# EAGLE design PCBPayloadV8 (EAGLE 9.5.2)
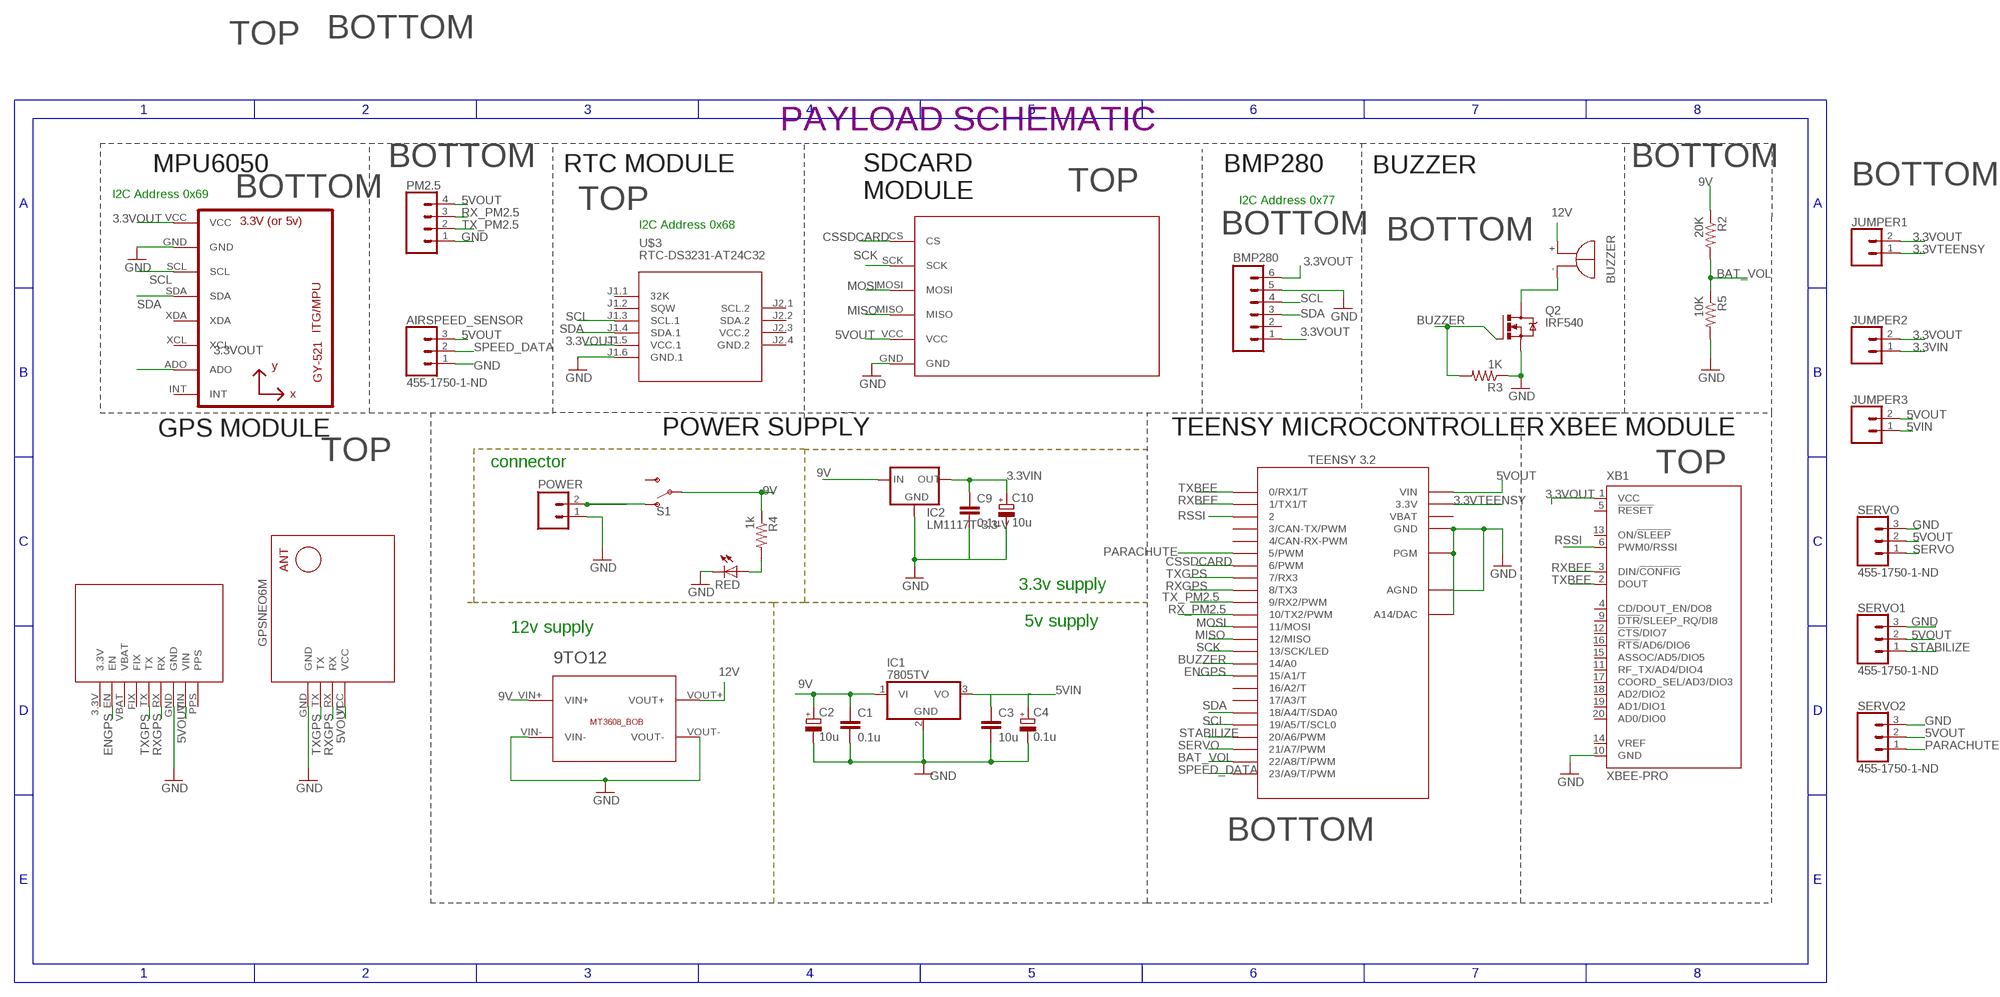
[diagram p0: schematic, sheet 1]

## Parts
9TO12  BREAKOUTS_MT3608_BOB  [BREAKOUTS_MT3608_BOB]
AIRSPEED_SENSOR  455-1750-1-ND  CONN_03  [1X03]
BMP280  M06  [06P]
C1  0.1u  C-EU025-025X050  [C025-025X050]
C2  10u  CPOL-EUE2.5-6  [E2,5-6]
C3  10u  C-EU025-025X050  [C025-025X050]
C4  0.1u  CPOL-EUE2.5-6  [E2,5-6]
C9  0.1u  C-EU025-025X050  [C025-025X050]
C10  10u  CPOL-EUE2.5-6  [E2,5-6]
IC1  7805TV  [TO220V]
IC2  LM1117T-3.3-V  [TO220V]
JUMPER1  CONN_02  [1X02]
JUMPER2  CONN_02  [1X02]
JUMPER3  CONN_02  [1X02]
PM2.5  CONN_04  [1X04]
POWER  CEDT_JANUARY_2015_V5_M02  [CEDT_JANUARY_2015_V5_02P]
Q2  IRF540  [TO220BV]
R2  20K  R-US_0204/7  [0204/7]
R3  1K  R-US_0204/7  [0204/7]
R4  1k  R-US_0204/7  [0204/7]
R5  10K  R-US_0204/7  [0204/7]
RED  red  LED3MM  [LED3MM]
S1  SWITCH-SPDT-PTH-11.6X4.0MM  [SWITCH_SPDT_PTH_11.6X4.0MM]
SERVO  455-1750-1-ND  CONN_03  [1X03]
SERVO1  455-1750-1-ND  CONN_03  [1X03]
SERVO2  455-1750-1-ND  CONN_03  [1X03]
SG1  BUZZER_EB2209A  [BUZZER_EB2209A]
U1  GY-521MPU6050  [GY-521]
U$1  GPS-RECEIVER-NEO6M  [GPS-RECEIVER-NEO6M]
U$2  TEENSY_3.1-3.2_OUTER_ROW  [TEENSY_3.0-3.2&LC_OUTER_ROW]
U$3  RTC-DS3231-AT24C32  [RTC-DS3231-AT24C32]
U$4  ADAFRUIT_GPS  [ADAFRUIT_GPS]
U$5  SDCARD  [M0SDCARDMODULE]
XB1  XBEE-PRO  [XBEE-PRO]

## Nets
3.3VIN: C9.1 C10.+ IC2.2(OUT) JUMPER2.1
3.3VOUT: BMP280.1 BMP280.6 JUMPER1.2 JUMPER2.2 U1.ADO U1.VCC U$3.J1.5(VCC.1) XB1.1(VCC)
3.3VTEENSY: JUMPER1.1 U$2.3.3V U$2.3.3V1(3.3V)
5VIN [power]: C3.1 C4.+ IC1.3(VO) JUMPER3.1
5VOUT: AIRSPEED_SENSOR.3 JUMPER3.2 PM2.5.4 SERVO1.2 SERVO2.2 SERVO.2 U$1.VCC U$2.VIN U$4.VIN U$5.VCC
9V [power]: 9TO12.VIN+ C1.1 C2.+ IC1.1(VI) IC2.3(IN) R2.1 R4.1 S1.2(P)
12V [power]: 9TO12.VOUT+ SG1.+
BAT_VOL: R2.2 R5.1 U$2.22/A8(22/A8/T/PWM)
BUZZER: Q2.G R3.2 U$2.14/A0
CSSDCARD: U$2.6(6/PWM) U$5.CS
ENGPS: U$2.15/A1(15/A1/T) U$4.EN
GND [power]: 9TO12.VIN- 9TO12.VOUT- AIRSPEED_SENSOR.1 BMP280.5 C1.2 C2.- C3.2 C4.- C9.2 C10.- IC1.2(GND) IC2.1(GND) PM2.5.1 POWER.1 Q2.S R3.1 R5.2 RED.K(C) SERVO1.3 SERVO2.3 SERVO.3 U1.GND U$1.GND U$2.AGND U$2.GND U$2.GND1(GND) U$2.PGM U$2.RESET/DAC(A14/DAC) U$3.J1.6(GND.1) U$4.GND U$5.GND XB1.10(GND)
MISO: U$2.12(12/MISO) U$5.MISO
MOSI: U$2.11(11/MOSI) U$5.MOSI
N$1 [power]: POWER.2 S1.1(O)
N$2: R4.2 RED.A
N$3 [power]: Q2.D SG1.-
PARACHUTE: SERVO2.1 U$2.5(5/PWM)
RSSI: U$2.2 XB1.6(PWM0/RSSI)
RX_PM2.5: PM2.5.3 U$2.10(10/TX2/PWM)
RXBEE: U$2.1(1/TX1/T) XB1.3(DIN/!CONFIG)
RXGPS: U$1.RX U$2.8(8/TX3) U$4.RX
SCK: U$2.13(13/SCK/LED) U$5.SCK
SCL: BMP280.4 U1.SCL U$2.19/A5(19/A5/T/SCL0) U$3.J1.3(SCL.1)
SDA: BMP280.3 U1.SDA U$2.18/A4(18/A4/T/SDA0) U$3.J1.4(SDA.1)
SERVO: SERVO.1 U$2.21/A7(21/A7/PWM)
SPEED_DATA: AIRSPEED_SENSOR.2 U$2.23/A9(23/A9/T/PWM)
STABILIZE: SERVO1.1 U$2.20/A6(20/A6/PWM)
TX_PM2.5: PM2.5.2 U$2.9(9/RX2/PWM)
TXBEE: U$2.0(0/RX1/T) XB1.2(DOUT)
TXGPS: U$1.TX U$2.7(7/RX3) U$4.TX
Unconnected: BMP280.2 S1.3(S) U1.INT U1.XCL U1.XDA U$2.3(3/CAN-TX/PWM) U$2.4(4/CAN-RX-PWM) U$2.16/A2(16/A2/T) U$2.17/A3(17/A3/T) U$3.J1.1(32K) U$3.J1.2(SQW) U$3.J2.1(SCL.2) U$3.J2.2(SDA.2) U$4.3.3V U$4.FIX U$4.PPS U$4.VBAT XB1.4(CD/DOUT_EN/DO8) XB1.5(!RESET) XB1.9(!DTR!/SLEEP_RQ/DI8) XB1.11(RF_TX/AD4/DIO4) XB1.12(!CTS!/DIO7) XB1.13(ON/!SLEEP) XB1.14(VREF) XB1.15(ASSOC/AD5/DIO5) XB1.16(!RTS!/AD6/DIO6) XB1.17(COORD_SEL/AD3/DIO3) XB1.18(AD2/DIO2) XB1.19(AD1/DIO1) XB1.20(AD0/DIO0)

## Notes on the sheet
- TOP | BOTTOM
- PAYLOAD SCHEMATIC
- MPU6050 | BOTTOM | RTC MODULE | BMP280 | BUZZER | BOTTOM
- TOP | BOTTOM
- I2C Address 0x69 | BOTTOM
- SDCARD
  MODULE
- I2C Address 0x77
- TOP
- I2C Address 0x68
- BOTTOM | BOTTOM
- GPS MODULE | POWER SUPPLY | TEENSY MICROCONTROLLER | XBEE MODULE
- TOP
- connector
- TOP
- 3.3v supply
- 5v supply
- 12v supply
- BOTTOM

## Power pins joined to a net without a drawn wire
GND.2: U$3.J2.4(GND.2)
VBAT: U$2.VBAT
VCC.2: U$3.J2.3(VCC.2)

## Library data of the parts
9TO12 = Cansat2019_3279_Container_v01:BREAKOUTS_MT3608_BOB
AIRSPEED_SENSOR SERVO SERVO1 SERVO2 = SparkFun-Connectors:CONN_03: Multi connection point. Often used as Generic Header-pin footprint for 0.1 inch spaced/style header connections On any of the 0.1 inch spaced packages, you can populate with these: Break Away Headers - Straight <https://www.sparkfun.com/products/116> (PRT-00116) Break Away Male Headers - Right Angle <https://www.sparkfun.com/products/553> (PRT-00553) Female Headers <https://www.sparkfun.com/products/115> (PRT-00115) Break Away Headers - Machine Pin <https://www.sparkfun.com/products/117> (PRT-00117) Break Away Female Headers - Swiss Machine Pin <https://www.sparkfun.com/products/743> (PRT-00743) Stackable Header - 3 Pin (Female, 0.1") <https://www.sparkfun.com/products/13875> (PRT-13875) For SCREWTERMINALS and SPRING TERMINALS visit here: Screw Terimnals on SparkFun.com <https://www.sparkfun.com/search/results?term=Screw+Terminals> (5mm/3.5mm/2.54mm spacing) This device is also useful as a general connection point to wire up your design to another part of your project. Our various solder wires solder well into these plated through hole pads. Hook-Up Wire - Assortment (Stranded, 22 AWG) <https://www.sparkfun.com/products/11375> (PRT-11375) Hook-Up Wire - Assortment (Solid Core, 22 AWG) <https://www.sparkfun.com/products/11367> (PRT-11367) View the entire wire category on our website here <https://www.sparkfun.com/categories/141> Special notes: Molex polarized connector foot print use with SKU : PRT-08232 with associated crimp pins and housings.; PROD_ID: XXX-00000
BMP280 = con-amp-quick:M06: AMP QUICK CONNECTOR; OC_FARNELL: unknown; OC_NEWARK: unknown
C1 C3 C9 = resistor:C-EU: CAPACITOR, European symbol
C2 C4 C10 = rcl:CPOL-EU: POLARIZED CAPACITOR, European symbol; SPICEPREFIX: C
IC1 = linear:78*: Positive VOLTAGE REGULATOR Source: http://cache.national.com/ds/LM/LM78L05.pdf http://www.fairchildsemi.com/ds/LM/LM7805.pdf
IC2 = lm1117:LM1117T-*
JUMPER1-JUMPER3 = SparkFun-Connectors:CONN_02: Multi connection point. Often used as Generic Header-pin footprint for 0.1 inch spaced/style header connections On any of the 0.1 inch spaced packages, you can populate with these: Break Away Headers - Straight <https://www.sparkfun.com/products/116> (PRT-00116) Break Away Male Headers - Right Angle <https://www.sparkfun.com/products/553> (PRT-00553) Female Headers <https://www.sparkfun.com/products/115> (PRT-00115) Break Away Headers - Machine Pin <https://www.sparkfun.com/products/117> (PRT-00117) Break Away Female Headers - Swiss Machine Pin <https://www.sparkfun.com/products/743> (PRT-00743) For SCREWTERMINALS and SPRING TERMINALS visit here: Screw Terimnals on SparkFun.com <https://www.sparkfun.com/search/results?term=Screw+Terminals> (5mm/3.5mm/2.54mm spacing) This device is also useful as a general connection point to wire up your design to another part of your project. Our various solder wires solder well into these plated through hole pads. Hook-Up Wire - Assortment (Stranded, 22 AWG) <https://www.sparkfun.com/products/11375> (PRT-11375) Hook-Up Wire - Assortment (Solid Core, 22 AWG) <https://www.sparkfun.com/products/11367> (PRT-11367) View the entire wire category on our website here <https://www.sparkfun.com/categories/141> Special notes: Molex polarized connector foot print use with: PRT-08233 with associated crimp pins and housings. 2.54_SCREWTERM for use with PRT-10571. 3.5mm Screw Terminal footprints for PRT-08084 5mm Screw Terminal footprints for use with PRT-08432
PM2.5 = SparkFun-Connectors:CONN_04: Multi connection point. Often used as Generic Header-pin footprint for 0.1 inch spaced/style header connections On any of the 0.1 inch spaced packages, you can populate with these: Break Away Headers - Straight <https://www.sparkfun.com/products/116> (PRT-00116) Break Away Male Headers - Right Angle <https://www.sparkfun.com/products/553> (PRT-00553) Female Headers <https://www.sparkfun.com/products/115> (PRT-00115) Break Away Headers - Machine Pin <https://www.sparkfun.com/products/117> (PRT-00117) Break Away Female Headers - Swiss Machine Pin <https://www.sparkfun.com/products/743> (PRT-00743) For SCREWTERMINALS and SPRING TERMINALS visit here: Screw Terimnals on SparkFun.com <https://www.sparkfun.com/search/results?term=Screw+Terminals> (5mm/3.5mm/2.54mm spacing) This device is also useful as a general connection point to wire up your design to another part of your project. Our various solder wires solder well into these plated through hole pads. Hook-Up Wire - Assortment (Stranded, 22 AWG) <https://www.sparkfun.com/products/11375> (PRT-11375) Hook-Up Wire - Assortment (Solid Core, 22 AWG) <https://www.sparkfun.com/products/11367> (PRT-11367) View the entire wire category on our website here <https://www.sparkfun.com/categories/141> Special notes: Molex polarized connector foot print use with SKU : PRT-08231 with associated crimp pins and housings. 1MM SMD Version SKU: PRT-10208; PROD_ID: CONN-09696
POWER = Cansat2019_3279_Container_v01:CEDT_JANUARY_2015_V5_M02: AMP QUICK CONNECTOR
Q2 = transistor-power:IRF540: HEXFET Power MOSFET
R2-R5 = rcl:R-US_: RESISTOR, American symbol; SPICEPREFIX: R
RED = CEDT_JANUARY_2015_v5:LED
S1 = SparkFun-Switches:SWITCH-SPDT: Single Pole, Double Throw (SPDT) Switch Single-pole, double-throw (SPDT) switch. Variant Overview SMD-AYZ0202 Surface Mount DPDT Switch <https://www.sparkfun.com/products/597> (COM-00597) Used on e.g. LilyPad Arduino USB - ATmega32U4 Board <https://www.sparkfun.com/products/12049> PTH-11.6X4.0MM SPDT Mini Power Switch <https://www.sparkfun.com/products/102> (COM-00102) Used on e.g. SparkFun Simon Says - Through-Hole Soldering Kit <https://www.sparkfun.com/products/10547> (KIT-10547) PTH-11.6X4.0MM-KIT KIT version of SPDT Mini Power Switch - Simplifies soldering by removing tStop of switch pins - only one side can be soldered. PTH-11.6X4.0MM-LOCK LOCK version of SPDT Mini Power Switch - Offset pins hold switch in place for easier soldering. SMD-RIGHT-ANGLE Surface Mount Right Angle Switch <https://www.sparkfun.com/products/10860> (COM-10860) Used on e.g. SparkFun ESP8266 Thing <https://www.sparkfun.com/products/13231>; PROD_ID: SWCH-08261; SF_SKU: COM-00102
SG1 = Cansat2019_3279_Container_v01:BUZZER_EB2209A: BUZZER Source: Buerklin; OC_FARNELL: unknown; OC_NEWARK: unknown
U1 = gy-521:GY-521
U$1 = diy-modules:GPS-RECEIVER-NEO6M: GPS Receiver Module based on NEO-6 device Short tutorial how to use NEO-6 module with Arduino: http://www.xarg.org/2016/06/neo6mv2-gps-module-with-arduino/ NEO-6 datasheet is available here: https://www.u-blox.com/sites/default/files/products/documents/NEO-6_DataSheet_%28GPS.G6-HW-09005%29.pdf Click here to find device on ebay.com <http://www.ebay.com/sch/gyneo6mv2>
U$2 = Teensy_3_and_LC_Series_Boards_v1.4:TEENSY_3.1-3.2_OUTER_ROW: Footprint for Teensy 3.1 or 3.2 board using all pin connections on the outer perimeter
U$3 = diy-modules:RTC-DS3231-AT24C32: RTC Module with Battery and EEPROM based on DS3231 and AT24C32 chips Tutorial can be found here: https://edwardmallon.wordpress.com/2014/05/21/using-a-cheap-3-ds3231-rtc-at24c32-eeprom-from-ebay/ Click here to find device on ebay.com <http://www.ebay.com/sch/DS3231+AT24C32+module>
U$4 = myLib_adafruit_gps:ADAFRUIT_GPS
U$5 = mylib:SDCARD
XB1 = maxstream:XBEE: XBee (TM) /XBee-PRO(TM) OEM RF Modules Source: MaxStream, Inc. xbee_productmanual.pdf; MPN: XBP24-AWI-001; OC_FARNELL: 1337916; OC_NEWARK: 42M2667

## Net classes
0 default: width 0.508 mm
1 power: width 0.61 mm

## Board
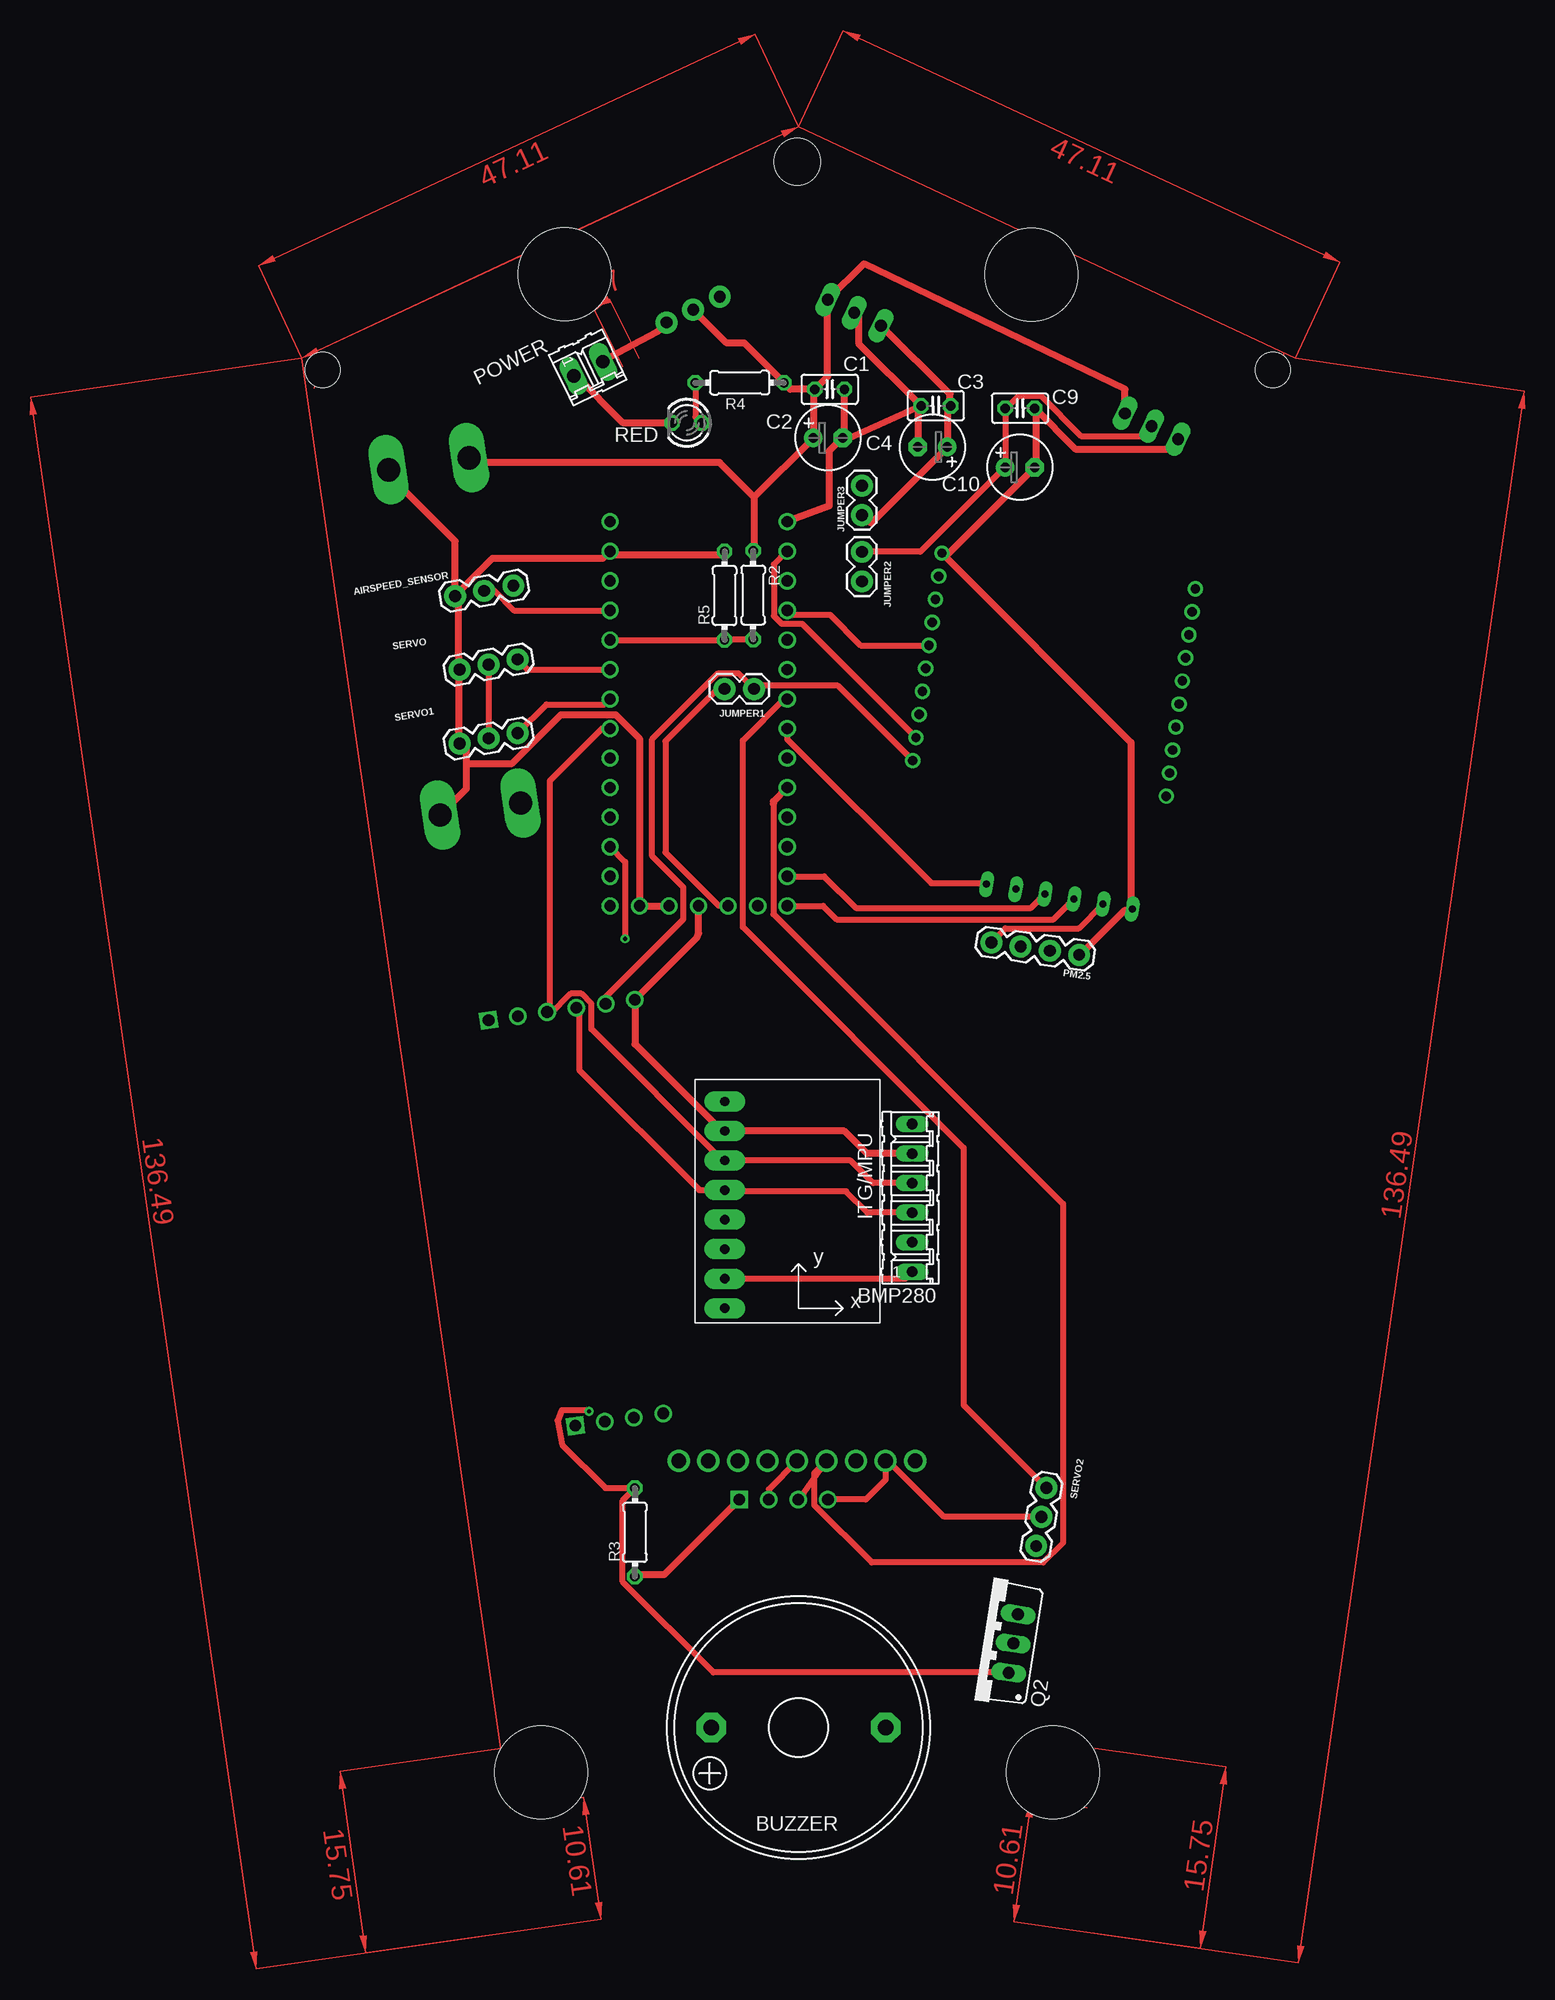
[diagram p1: board, top side]
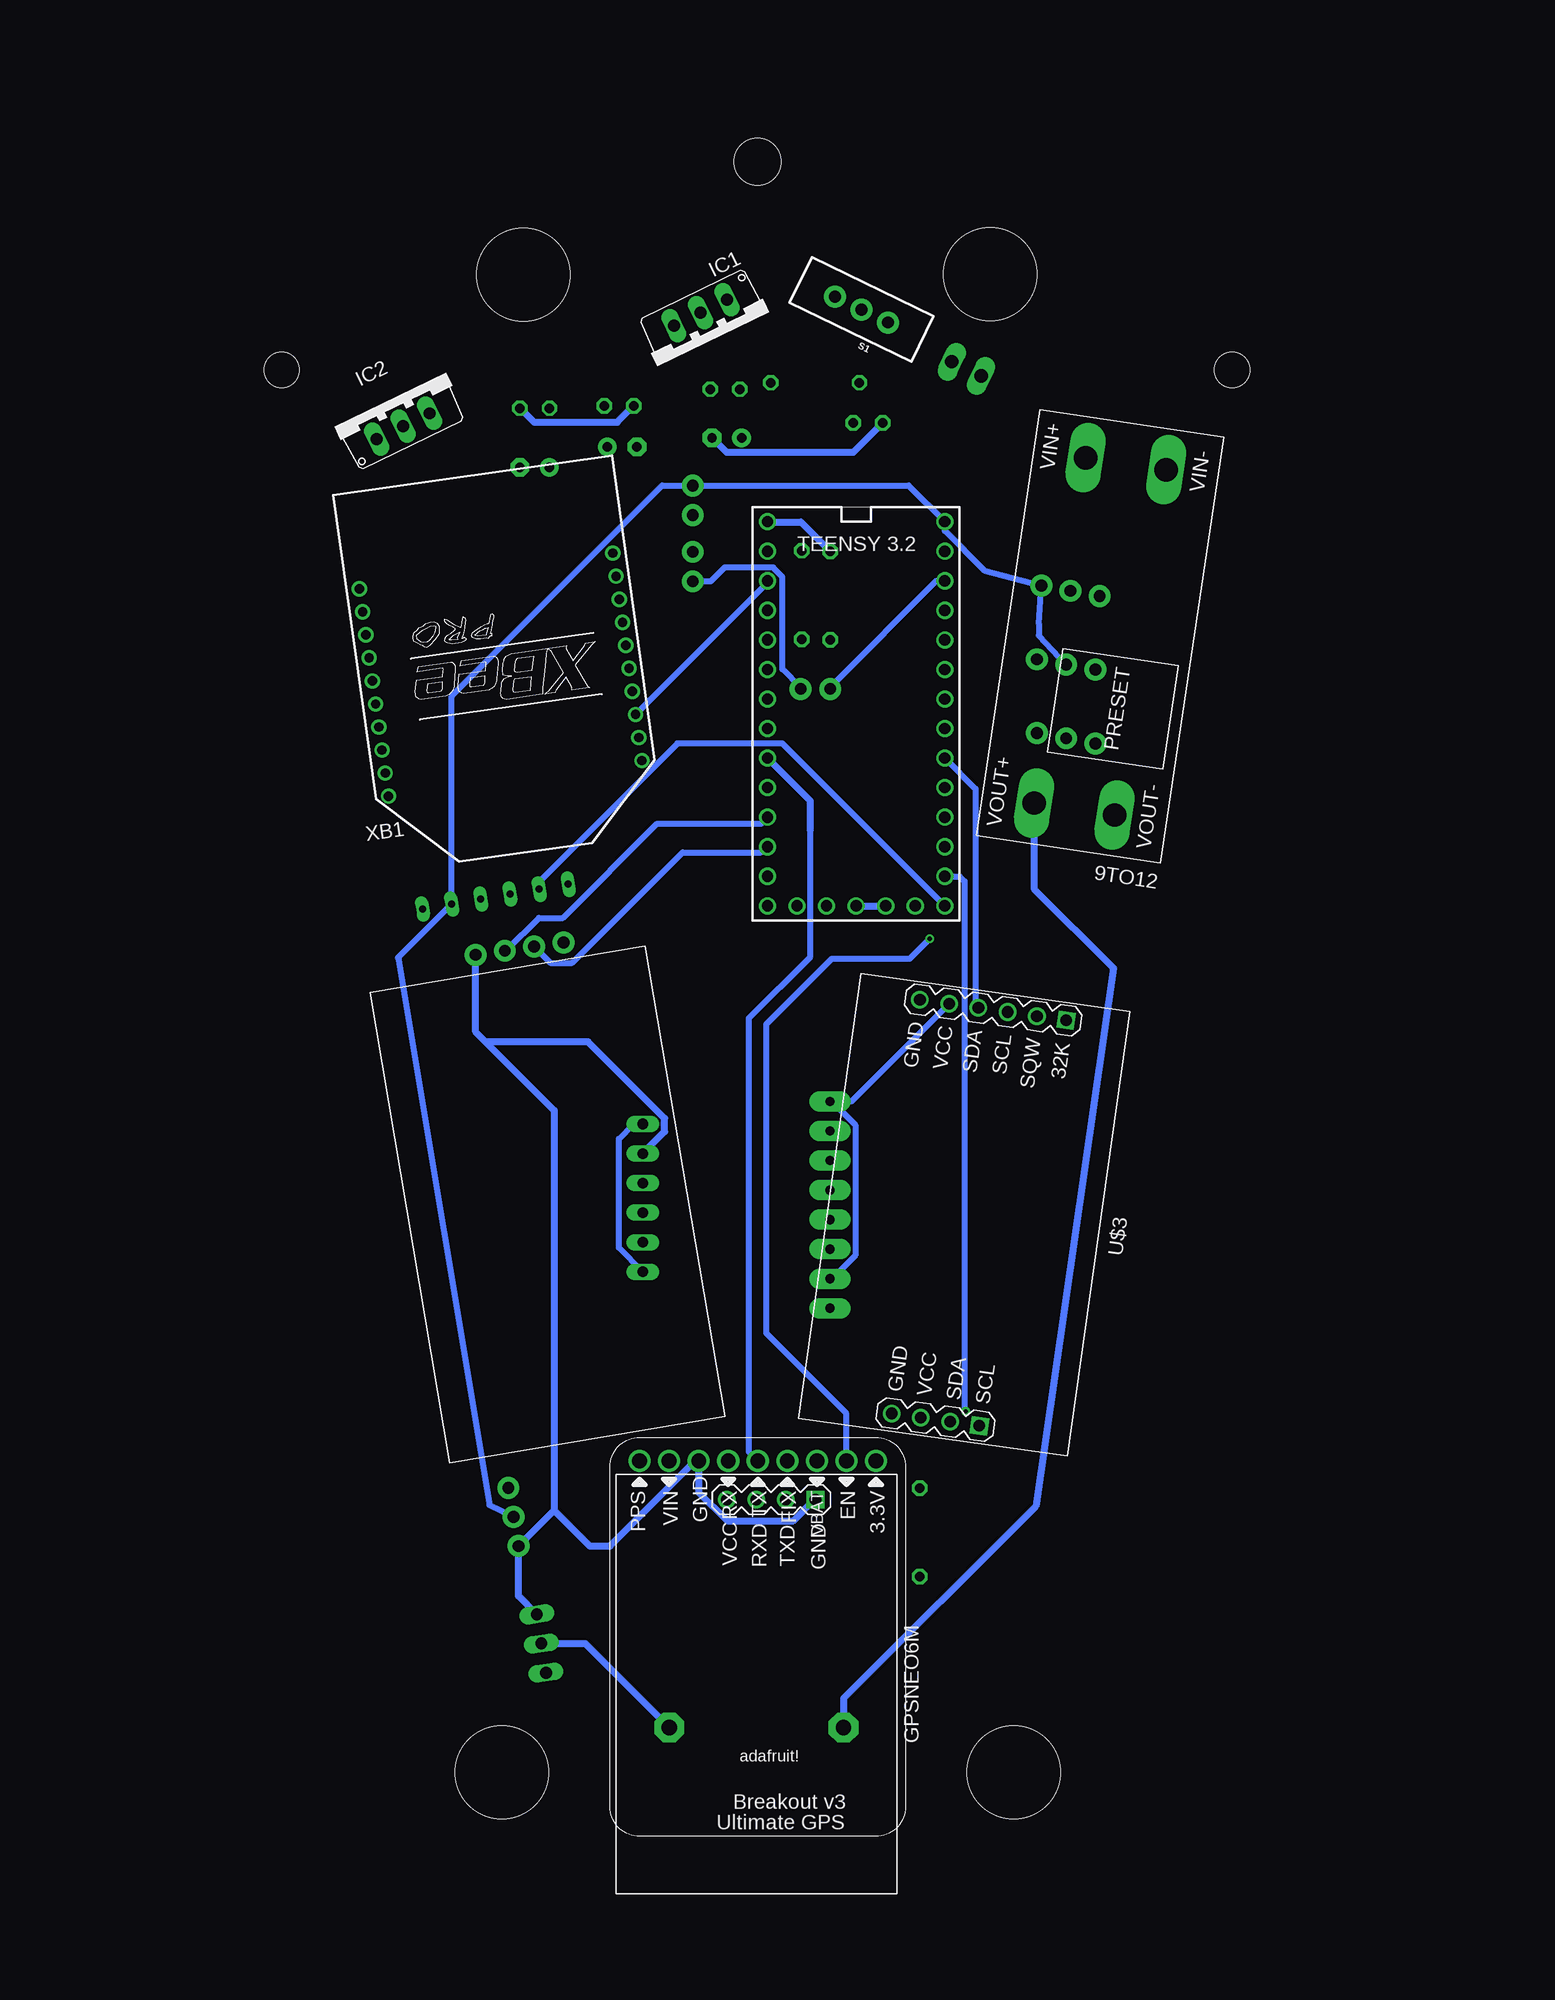
[diagram p2: board, bottom side, seen from below]

No outline drawn. Coordinates in mm, seen from the top.
Copper layers (1*16): Top 0.035mm / dielectric 1.5mm / Bottom 0.035mm
Design rules "default": minimum track width 6mil, minimum drill 0.35mm, track to track 6mil, track to pad 6mil, pad to pad 6mil, via to via 6mil, smd to smd 6mil, copper to edge 40mil, drill to drill 6mil, minimum pad ring 10mil, minimum via ring 8mil, stop-mask expansion 4mil, vias tented up to drill 0mil, thermal gap 10mil
Holes 4 mm at -0.1,152
Holes 8 mm at -22.12,13.56 21.87,13.56 -20.1,142.32 20.03,142.29
Holes 3 mm at -40.9,134.1 40.8,134.1

### Footprints (pad centres in the part's own frame; a part is rotated, then mirrored left to right if it is on the bottom)
BREAKOUTS_MT3608_BOB = drill 2 pad 3 long: VIN+ 33.5,-4.5; VIN- 33.5,-11.5; VOUT+ 3.5,-4.5; VOUT- 3.5,-11.5
1X03 = drill 1.016 pad 1.88: 1 0,0; 2 2.54,0; 3 5.08,0
06P = drill 0.914 long: 1 -6.35,0; 2 -3.81,0; 3 -1.27,0; 4 1.27,0; 5 3.81,0; 6 6.35,0
C025-025X050 = drill 0.813 octagon: 1 -1.27,0; 2 1.27,0
E2,5-6 = drill 0.813 pad 1.6: + -1.27,0 | drill 0.813 pad 1.6 octagon: - 1.27,0
TO220V = drill 1.016 long: 1 -2.54,-2.54; 2 0,-2.54; 3 2.54,-2.54
1X02 = drill 1.016 pad 1.88: 1 0,0; 2 2.54,0
1X04 = drill 1.016 pad 1.88: 1 0,0; 2 2.54,0; 3 5.08,0; 4 7.62,0
CEDT_JANUARY_2015_V5_02P = drill 1.143 long: 1 -1.397,0; 2 1.397,0
TO220BV = drill 1.016 long: D 0,-2.54; G -2.54,-2.54; S 2.54,-2.54
0204/7 = drill 0.813 octagon: 1 -3.81,0; 2 3.81,0
LED3MM = drill 0.813 octagon: A -1.27,0; K 1.27,0
SWITCH_SPDT_PTH_11.6X4.0MM = drill 1.016 pad 1.88: 1 0,2.54; 2 0,0; 3 0,-2.54
BUZZER_EB2209A = drill 1.321 pad 2.54 octagon: + 7.493,0; - -7.493,0
GY-521 = drill 0.8 pad 1.778 long: ADO -8.89,-6.35; GND -8.89,6.35; INT -8.89,-8.89; SCL -8.89,3.81; SDA -8.89,1.27; VCC -8.89,8.89; XCL -8.89,-3.81; XDA -8.89,-1.27
GPS-RECEIVER-NEO6M = drill 1 square: GND -15.875,5.08 | drill 1: RX -15.875,0; TX -15.875,2.54; VCC -15.875,-2.54
TEENSY_3.0-3.2&LC_OUTER_ROW = drill 0.965: 0 -7.62,13.97; 1 -7.62,11.43; 2 -7.62,8.89; 3 -7.62,6.35; 3.3V 7.62,11.43; 3.3V1 -2.54,-16.51; 4 -7.62,3.81; 5 -7.62,1.27; 6 -7.62,-1.27; 7 -7.62,-3.81; 8 -7.62,-6.35; 9 -7.62,-8.89; 10 -7.62,-11.43; 11 -7.62,-13.97; 12 -7.62,-16.51; 13 7.62,-16.51; 14/A0 7.62,-13.97; 15/A1 7.62,-11.43; 16/A2 7.62,-8.89; 17/A3 7.62,-6.35; 18/A4 7.62,-3.81; 19/A5 7.62,-1.27; 20/A6 7.62,1.27; 21/A7 7.62,3.81; 22/A8 7.62,6.35; 23/A9 7.62,8.89; AGND 7.62,13.97; GND -7.62,16.51; GND1 0,-16.51; PGM 2.54,-16.51; RESET/DAC 5.08,-16.51; VBAT -5.08,-16.51; VIN 7.62,16.51
RTC-DS3231-AT24C32 = drill 1 square: J1.1 -17.78,6.35; J2.1 17.78,3.81 | drill 1: J1.2 -17.78,3.81; J1.3 -17.78,1.27; J1.4 -17.78,-1.27; J1.5 -17.78,-3.81; J1.6 -17.78,-6.35; J2.2 17.78,1.27; J2.3 17.78,-1.27; J2.4 17.78,-3.81
ADAFRUIT_GPS = drill 1.27: 3.3V 2.54,2.032; EN 5.08,2.032; FIX 10.16,2.032; GND 17.78,2.032; PPS 22.86,2.032; RX 15.24,2.032; TX 12.7,2.032; VBAT 7.62,2.032; VIN 20.32,2.032
M0SDCARDMODULE = drill 0.6 long: CS -6.35,6.35; GND -6.35,-6.35; MISO -6.35,-1.27; MOSI -6.35,1.27; SCK -6.35,3.81; VCC -6.35,-3.81
XBEE-PRO = drill 0.8 pad 1.27: 1 -11,9; 2 -11,7; 3 -11,5; 4 -11,3; 5 -11,1; 6 -11,-1; 7 -11,-3; 8 -11,-5; 9 -11,-7; 10 -11,-9; 11 11,-9; 12 11,-7; 13 11,-5; 14 11,-3; 15 11,-1; 16 11,1; 17 11,3; 18 11,5; 19 11,7; 20 11,9

### Placement (x,y rotation side)
9TO12  -18.91,94.08 81.5 bottom
AIRSPEED_SENSOR  -29.51,114.67 10 top
BMP280  9.77,62.93 90 top
C1  2.69,132.44 0 top
C2  2.54,128.27 0 top
C3  11.81,131.02 180 top
C4  11.53,127.47 180 top
C9  19.05,130.81 0 top
C10  19.05,125.73 0 top
IC1  3.69,136.73 205.9 bottom
IC2  31.47,131.54 25.9 bottom
JUMPER1  -6.35,106.68 0 top
JUMPER2  5.46,118.46 270 top
JUMPER3  5.46,121.62 90 top
PM2.5  24.13,83.82 172 top
POWER  -18.06,134.2 25.9 top
Q2  15.97,25.02 81 top
R2  -3.89,114.75 270 top
R3  -14.05,34.18 90 top
R4  -5.05,133 180 top
R5  -6.35,114.7 90 top
RED  -9.59,129.54 180 top
S1  -9.04,139.28 244.1 bottom
SERVO  -24.13,109.22 190 top
SERVO1  -24.13,102.87 190 top
SERVO2  21.32,38 260 top
SG1  0,17.4 180 top
U1  2.56,62.33 0 top
U$1  0,21.12 270 bottom
U$2  -8.58,104.54 0 bottom
U$3  -17.87,61.48 262 bottom
U$4  -12.82,42.34 180 bottom
U$5  21.38,82.57 279.6 bottom
XB1  21.98,107.9 188 bottom

### Tracks (layer width: path | path; a pad name or v marks a point on that pad's centre or on a via)
3.3VIN
  Top 0.508: JUMPER2.1 10.48,118.46 17.75,125.73 C10.+ 17.83,125.81 17.83,130.76 C9.1 17.88,130.81 18.95,131.88 20.84,131.88 24.3,128.42 29.53,128.42 IC2.2
3.3VOUT
  Top 0.508: U$3.J1.5 -16.57,80.2 -9.89,86.89 -9.89,89.62 -12.57,92.3 -12.57,102.36 -6.91,108.03 -5.16,108.03 JUMPER1.2 -3.54,106.95 3.4,106.95 XB1.1 | BMP280.1 9.17,55.98 U1.ADO
  Bottom 0.508: U1.ADO -6.58,56.23 -6.76,56.23 -8.51,57.98 -8.51,69.22 -6.51,71.22 U1.VCC -8.18,71.22 U$3.J1.5 | JUMPER1.2 -3.81,106.81 -2.24,108.38 -2.24,116.31 -1.43,117.11 2.73,117.11 3.92,115.92 JUMPER2.2 | BMP280.1 11.82,58.63 11.82,68 10.54,69.28 BMP280.6
3.3VTEENSY
  Top 0.508: U$2.3.3V1 -6.84,88.03 -11.44,92.63 -11.44,102.19 -6.95,106.68 JUMPER1.1
  Bottom 0.508: U$2.3.3V -15.5,115.97 -6.6,107.07 -6.44,107.07 -6.44,106.82 JUMPER1.1
5VIN
  Top 0.61: IC1.3 13.04,132.04 13.04,131.06 C3.1 12.8,130.74 C4.+ 6.26,120.93 JUMPER3.1
5VOUT
  Top 0.508: SERVO2.2 20.86,35.52 12.52,35.52 8.01,40.04 U$4.VIN 7.5,38.7 5.79,37 U$1.VCC | PM2.5.4 17.8,86.09 24.09,86.09 U$5.VCC | SERVO.2 SERVO1.2
  Bottom 0.508: AIRSPEED_SENSOR.3 -19.61,116.87 -16.2,120.28 U$2.VIN -13.09,124.16 JUMPER3.2 8.1,124.16 26.19,106.06 U$5.VCC 30.8,83.58 22.94,36.51 SERVO2.2 | AIRSPEED_SENSOR.3 | SERVO.2 -24.28,111.27 -24.28,112.31 AIRSPEED_SENSOR.3
9V
  Top 0.61: C1.1 -0.68,132.44 R4.1 -4.65,136.41 -6.17,136.41 S1.2 | -3.8,123.17 -3.8,119.29 R2.1 | -3.8,123.17 1.16,128.12 C2.+ 1.32,128.45 1.32,131.99 C1.1 | -3.8,123.17 -6.77,126.14 -27.9,126.14 9TO12.VIN+ | IC2.3 28.08,132.43 5.62,143.23 IC1.1 2.52,133.54 C1.1
12V
  Bottom 0.61: 9TO12.VOUT+ -23.88,89.5 -30.7,82.68 -24.02,36.42 -7.49,19.9 SG1.+
BAT_VOL
  Top 0.508: R2.2 -3.91,110.92 -6.32,110.92 R5.1 -6.39,110.85 -16.05,110.85 U$2.22/A8
BUZZER  (via drill 0.35)
  Top 0.508: Q2.G -7.31,22.13 -15.12,29.93 -15.12,36.92 R3.2 -16.59,37.99 -20.3,41.7 -20.71,43.78 -20.34,44.68 -18.1,44.68 v-18,44.58
  Bottom 0.508: U$2.14/A0 -17.47,90.57 -17.9,90.14 -17.9,44.78 -18,44.68 v-18,44.58
CSSDCARD
  Top 0.508: U$2.6 -0.96,102.36 11.42,89.98 16.02,89.98 U$5.CS
ENGPS  (via drill 0.35)
  Top 0.508: U$2.15/A1 -14.9,91.81 v-14.9,85.2
  Bottom 0.508: U$4.EN -7.74,44.39 -0.83,51.3 -0.83,77.84 -6.49,83.5 -13.2,83.5 v-14.9,85.2
GND
  Top 0.61: PM2.5.1 24.27,83.87 28.07,87.67 28.56,87.67 U$5.GND 28.6,87.87 28.6,102.09 XB1.10 12.94,118.34 C10.- 20.47,125.97 20.47,130.76 C9.2 23.88,127.25 31.76,127.25 IC2.1 | BMP280.5 5.89,66.74 3.96,68.68 U1.GND -6.58,68.68 -14.06,76.16 U$3.J1.6 -8.75,85.27 -8.58,85.69 U$2.GND1 | AIRSPEED_SENSOR.1 -29.22,114.67 -29.22,109.46 SERVO.3 -29.22,109.13 -29.22,103.02 SERVO1.3 -29.06,102.69 -28.56,102.2 -28.56,100.27 | -35.49,125.34 -35.51,125.37 | C4.- 10.26,130.74 C3.2 | IC1.2 5.18,138.64 5.18,136.38 C3.2 | R5.2 -6.61,118.21 -15.75,118.21 U$2.AGND -16.83,117.88 -26.33,117.88 -29.51,114.7 AIRSPEED_SENSOR.1 | 3.96,128.28 C2.- 3.63,128.12 2.64,127.13 2.64,122.4 U$2.GND | C3.2 3.96,128.06 3.96,128.28 | -28.56,100.27 -24.61,100.27 -20.42,104.46 -15.71,104.46 -13.66,102.42 U$2.RESET/DAC U$2.PGM | 9TO12.VIN- -35.33,125.48 -35.49,125.34 | -28.56,100.27 -28.56,98.08 9TO12.VOUT- | AIRSPEED_SENSOR.1 -29.51,119.37 -35.49,125.34 | RED.K -15.06,129.54 -19.1,133.59 POWER.1 | 3.96,128.28 C1.2 | R3.1 -13.88,30.54 -11.54,30.54 U$1.GND
  Bottom 0.61: R5.2 -3.84,121.02 -0.97,121.02 U$2.GND | U$2.PGM -11.06,88.03 U$2.GND1 | 23.26,76.33 17.38,70.45 17.38,36.06 | PM2.5.1 24.13,77.2 23.26,76.33 | C3.2 11.97,129.59 19.1,129.59 C9.2 | C2.- 2.55,127.01 -8.33,127.01 RED.K | BMP280.5 7.89,68.62 7.89,69.76 14.46,76.33 23.26,76.33 | U$1.GND -5.01,37 -3.18,35.17 2.5,35.17 4.96,37.63 U$4.GND 5.26,40.31 12.56,33.01 13.36,33.01 14.32,33.01 17.38,36.06 | 17.38,36.06 SERVO2.3 20.44,28.7 Q2.S
MISO
  Top 0.508: U$2.12 2.12,88.03 3.28,86.86 21.94,86.86 U$5.MISO
MOSI
  Top 0.508: U$2.11 2.22,90.57 4.94,87.84 19.99,87.84 U$5.MOSI
N$1
  Top 0.61: S1.1 -12.15,137.35 -16.91,134.81 POWER.2
N$2
  Top 0.508: R4.2 -8.86,130.08 RED.A
N$3
  Bottom 0.61: Q2.D 14.72,24.63 SG1.-
PARACHUTE
  Top 0.508: SERVO2.1 14.2,45.13 14.2,67.22 -4.78,86.2 -4.78,102.25 -1.1,105.94 -0.83,105.66 U$2.5
RSSI
  Top 0.508: U$2.2 -0.59,113.06 2.72,113.06 5.35,110.42 XB1.6
RX_PM2.5
  Top 0.508: PM2.5.3 19.27,83.82
  Bottom 0.508: PM2.5.3 17.7,83.13 15.83,83.13 6.34,92.62 -0.4,92.62 U$2.10
RXBEE
  Bottom 0.508: XB1.3 -0.96,115.83 U$2.1
RXGPS
  Top 0.508: U$1.RX 0.05,36.96 U$4.RX 1.38,39.27 1.38,36.52 6.32,31.58 21.03,31.58 22.75,33.29 22.75,62.41 -2.15,87.31 -2.15,96.79
  Top 0.61: U$2.8 -2.15,97 -2.15,96.79
SCK
  Bottom 0.508: U$5.SCK 18.77,90.01 6.78,102 -2.23,102 U$2.13
SCL
  Top 0.508: BMP280.4 6.42,64.2 4.48,66.14 U1.SCL -6.43,66.24 -6.62,66.24 -17.8,77.42 -17.8,79.61 -18.66,80.48 -19.57,80.48 -21.35,78.7 | U$2.19/A5 -16.88,103.27 -21.35,98.79 -21.35,78.7 | -21.35,78.7 -21.58,78.47 U$3.J1.3
SDA
  Top 0.508: BMP280.3 5.92,61.66 4.09,63.49 -6.22,63.49 U1.SDA -8.52,63.6 -18.85,73.94 -18.85,79.02 U$3.J1.4
  Bottom 0.508: U$2.18/A4 -18.85,98.08 -18.85,79.5 U$3.J1.4
SERVO
  Top 0.508: SERVO.1 -23.26,108.35 U$2.21/A7
SPEED_DATA
  Top 0.508: AIRSPEED_SENSOR.2 -26.12,115.11 -24.44,113.43 U$2.23/A9
STABILIZE
  Top 0.508: U$2.20/A6 -16.68,105.33 -21.67,105.33 SERVO1.1
TX_PM2.5
  Bottom 0.508: PM2.5.2 21.52,84.17 18.68,87 16.63,87 8.54,95.1 -0.41,95.1 U$2.9
TXBEE
  Top 0.508: XB1.2 0.33,112.29 -1.43,112.29 -2.1,112.96 -2.1,117.37 U$2.0
TXGPS
  Top 0.508: U$4.TX -2.54,37.89 U$1.TX
  Bottom 0.508: U$4.TX 0.66,41.09 0.66,78.35 -4.64,83.66 -4.64,94.51
  Bottom 0.61: -4.64,94.51 -4.64,97.05 U$2.7
(copper drawn outside any net)
  shapes: Top area x17